# Altium project Limbo.PrjPcb
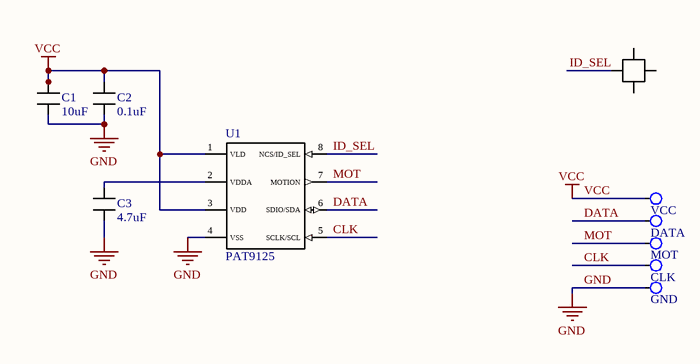
[diagram p0: SlipSensorEvalBoard.SchDoc]
2 sheets, 10 parts. Net scope: global (net labels, ports and power ports of the same name join across sheets).
Board file: SlipSensorEvalBoard.PcbDoc
Sheets:
  SlipSensorEvalBoard.SchDoc
  Palm.SchDoc

## Sheet SlipSensorEvalBoard.SchDoc
size 149 x 100 mm

### Parts
C1  10uF  [CAPC0816X55N]
C2  0.1uF  [cap_0.1uF]
C3  4.7uF  [CAPC0816X55N]
CLK  Holepad  [Holepad]  (value not drawn)
DATA  Holepad  [Holepad]  (value not drawn)
GND  Holepad  [Holepad]  (value not drawn)
ID_SEL  Wirepad  [Wirepad]  (value not drawn)
MOT  Holepad  [Holepad]  (value not drawn)
U1  Optical Navigation Sensor  [PAT9125]  (value not drawn)
VCC  Holepad  [Holepad]  (value not drawn)

### Nets
GND: C1.1 C2.1 C3.1 GND.1 U1.4(VSS)
VCC: C1.2 C2.2 U1.1(VLD) U1.3(VDD) VCC.1
CLK: CLK.1 U1.5(SCLK/SCL)
DATA: DATA.1 U1.6(SDIO/SDA)
ID_SEL: ID_SEL.2(Q?) U1.8(NCS/ID_SEL)
MOT: MOT.1 U1.7(MOTION)
NetC3_2: C3.2 U1.2(VDDA)

Not connected (* = marked no-connect by the designer): ID_SEL 1(Q?) 3(Q?) 4(Q?)

### Library data of the parts
C1 = cap_10uF: 10µF ±20% 2.5V Ceramic Capacitor X6S 0306 (0816 Metric); MF: Taiyo Yuden; MP: PWK107C6106MV-T; Value: *; Package: 0816 Taiyo Yuden; Check_prices: https://www.snapeda.com/parts/PWK107C6106MV-T/Taiyo%20Yuden/view-part/2037078/?ref=eda; Purchase-URL: https://pricing.snapeda.com/search/part/PWK107C6106MV-T/?ref=eda; SnapEDA_Link: https://www.snapeda.com/parts/PWK107C6106MV-T/Taiyo%20Yuden/view-part/2037078/?ref=snap; Digi-Key_Part_Number: 587-5158-1-ND; Category: Capacitor
C2 = cap_0.1uF: 0.1µF ±20% 6.3V Ceramic Capacitor X7S 0204 (0510 Metric); MP: JWK105C7104MP-F; MF: Taiyo Yuden; Category 2: Ceramic Capacitors; SnapEDA_Link: https://www.snapeda.com/parts/JWK105C7104MP-F/Taiyo%20Yuden/view-part/554958/?ref=snap; Check_prices: https://www.snapeda.com/parts/JWK105C7104MP-F/Taiyo%20Yuden/view-part/554958/?ref=eda; Value: 0.1uF; Package: 0510 Taiyo Yuden; Digi-Key_Part_Number: 587-2152-1-ND; Purchase-URL: https://pricing.snapeda.com/search/part/JWK105C7104MP-F/?ref=eda; Category: Capacitors
C3 = cap_4.7uF: 4.7µF ±20% 4V Ceramic Capacitor X6S 0306 (0816 Metric); MP: AWK107C6475MV-T; MF: Taiyo Yuden; Digi-Key_Part_Number: 587-5162-1-ND; Package: 0816 Taiyo Yuden; SnapEDA_Link: https://www.snapeda.com/parts/AWK107C6475MV-T/Taiyo%20Yuden/view-part/2039935/?ref=snap; Purchase-URL: https://pricing.snapeda.com/search/part/AWK107C6475MV-T/?ref=eda; Value: *; Check_prices: https://www.snapeda.com/parts/AWK107C6475MV-T/Taiyo%20Yuden/view-part/2039935/?ref=eda; Category: Capacitor
ID_SEL = Wirepad: SMD pad to solder a wire straight onto the PCB.
U1 = PAT9125: Miniature Optical Navigation Chip; HelpURL: https://www.pixart.com/products-detail/72/PAT9125EL-TKIT___TKMT; Name: PAT9125

## Sheet Palm.SchDoc
size A